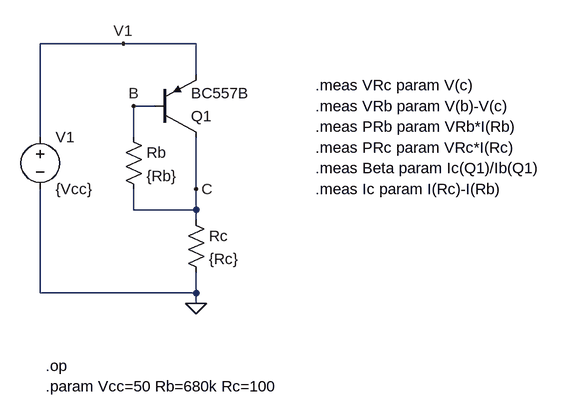
[diagram p0: schematic TBJ04a.asc]
TBJ04a.asc, the LTspice schematic file:
Version 4
SHEET 1 984 680
WIRE 256 -32 128 -32
WIRE 368 -32 256 -32
WIRE 368 16 368 -32
WIRE 304 64 272 64
WIRE 128 112 128 -32
WIRE 272 112 272 64
WIRE 368 192 368 112
WIRE 272 224 272 192
WIRE 368 224 368 192
WIRE 368 224 272 224
WIRE 368 240 368 224
WIRE 128 352 128 192
WIRE 368 352 368 320
WIRE 368 352 128 352
WIRE 368 368 368 352
FLAG 368 368 0
FLAG 256 -32 V1
FLAG 272 64 B
FLAG 368 192 C
SYMBOL voltage 128 96 R0
WINDOW 123 0 0 Left 0
WINDOW 39 0 0 Left 0
SYMATTR InstName V1
SYMATTR Value {Vcc}
SYMBOL res 256 96 R0
SYMATTR InstName Rb
SYMATTR Value {Rb}
SYMBOL res 352 224 R0
SYMATTR InstName Rc
SYMATTR Value {Rc}
SYMBOL pnp 304 112 M180
SYMATTR InstName Q1
SYMATTR Value BC557B
TEXT 136 464 Left 2 !.op
TEXT 136 496 Left 2 !.param Vcc=50 Rb=680k Rc=100
TEXT 552 32 Left 2 !.meas VRc param V(c)
TEXT 552 64 Left 2 !.meas VRb param V(b)-V(c)
TEXT 552 96 Left 2 !.meas PRb param VRb*I(Rb)
TEXT 552 128 Left 2 !.meas PRc param VRc*I(Rc)
TEXT 552 160 Left 2 !.meas Beta param Ic(Q1)/Ib(Q1)
TEXT 552 192 Left 2 !.meas Ic param I(Rc)-I(Rb)

The netlist it stands for:
* TBJ04a.asc
V1 V1 0 {Vcc}
Rb B C {Rb}
Rc C 0 {Rc}
Q1 C B V1 0 BC557B
.model NPN NPN
.model PNP PNP
.lib standard.bjt
.op
.param Vcc=50 Rb=680k Rc=100
.meas VRc param V(c)
.meas VRb param V(b)-V(c)
.meas PRb param VRb*I(Rb)
.meas PRc param VRc*I(Rc)
.meas Beta param Ic(Q1)/Ib(Q1)
.meas Ic param I(Rc)-I(Rb)
.backanno
.end